# EasyEDA Pro project CH32V003J4M6 DIP8 Devboard.eprj

# Schematic DevboardSchematic
Board Name: Devboard2; Create Date: 2025-11-19; Page Name: P1; Project Name: CH32V003J4M6 DIP8 Devboard; Schematic Name: DevboardSchematic; Update Date: 2026-02-17; Company: m039; Drawn: Dmitry Mozgin; Page Size: A4; Version: V1.0
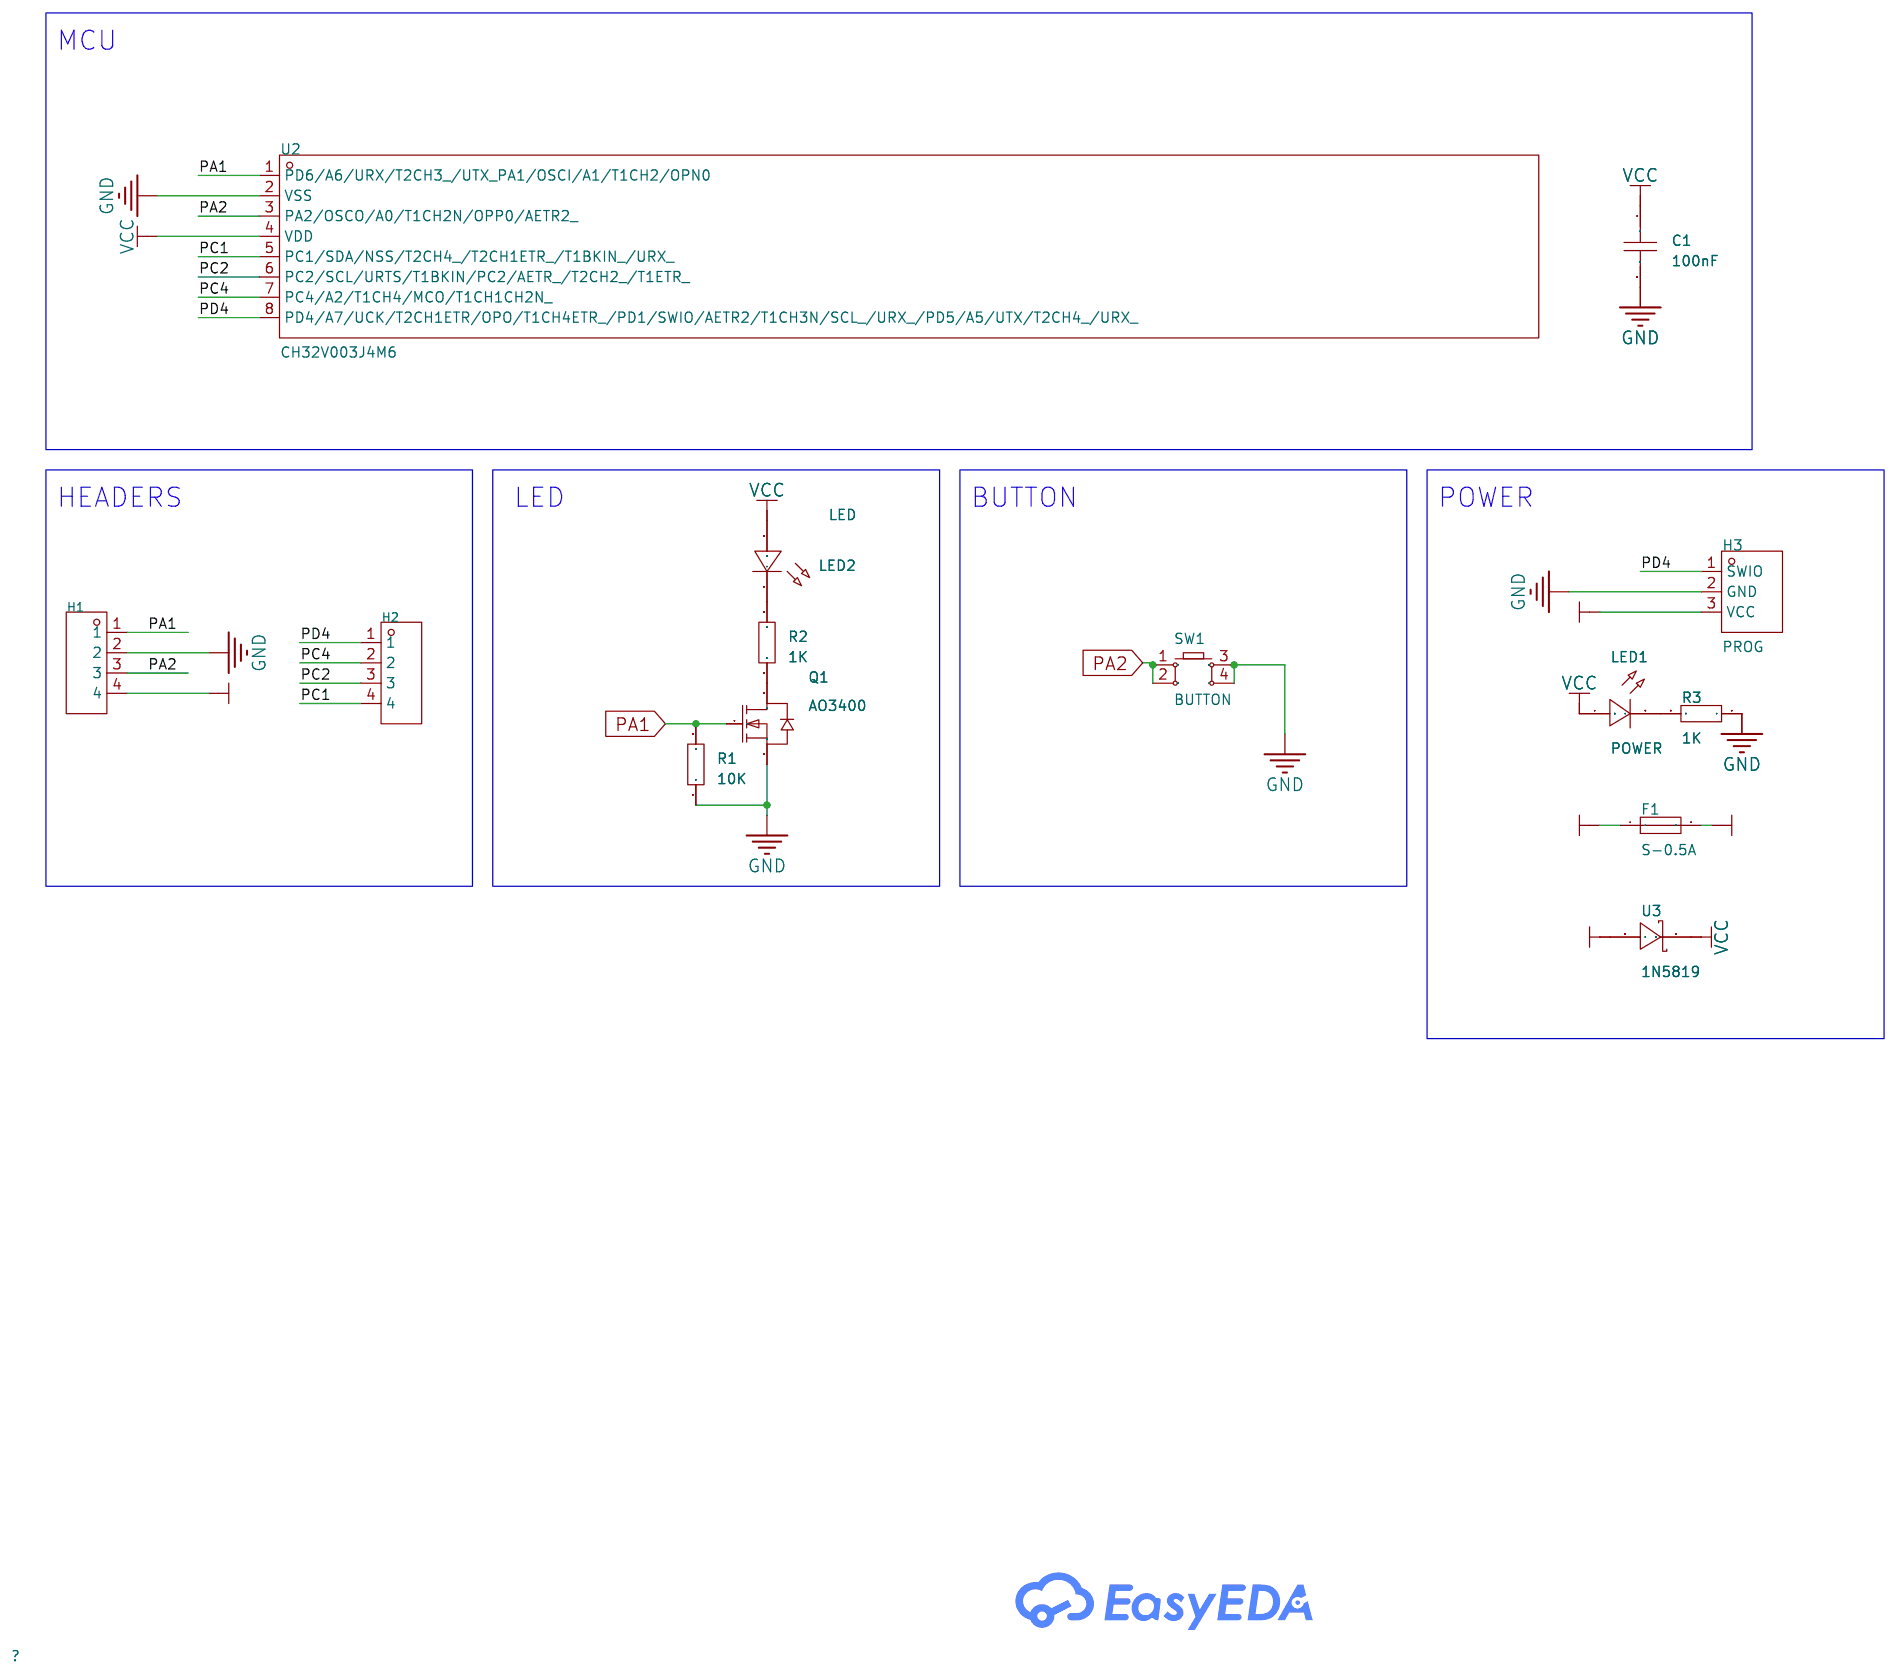
[diagram p0: schematic sheet]

## Parts
C1  100nF  [C0603]
F1  S-0.5A  [F0603]
H1  -  [HDR-TH_4P-P2.54-V-F]
H2  -  [HDR-TH_4P-P2.54-V-F]
H3  PROG  [HDR-TH_3P-P2.54-V-M]
LED1  POWER  [LED-TH_BD3.8-P2.54-FD_BLUE]
LED2  LED  [LED-TH_BD3.8-P2.54-FD_BLUE]
Q1  AO3400  [SOT-23-3_L2.9-W1.6-P1.90-LS2.8-BR]
R1  10K  [R0603]
R2  1K  [R0603]
R3  1K  [R0603]
SW1  BUTTON  [KEY-TH_4P-L6.0-W6.0-P3.90-LS6.5]
U2  CH32V003J4M6  [DIP-8_L9.6-W6.4-P2.54-LS7.9-BL]
U3  1N5819  [SOD-123_L2.7-W1.7-LS3.8-RD]

## Library data of the parts
C1 = CAP_0603: Supplier Footprint: 0603
F1 = S0603-S-1.0A: LCSC Part Name: 贴片式陶瓷保险丝; Supplier Part: C553912; Manufacturer: SART(萨特); Supplier Footprint: 0603; JLCPCB Part Class: Extended Part; Datasheet: https://item.szlcsc.com/datasheet/S0603-S-1.0A/574949.html; Supplier: LCSC; Type: Surface Mount Fuse; Current Rating: 1A; Voltage Rating (DC): 32V; Operating Temperature: -55℃~+125℃; Interrupt Rating: 50A
H1 H2 = HDR-F_2.54_1x4P: Supplier Footprint: Through
H3 = CH32V003 SWIO Header: Supplier Footprint: Through
LED1 LED2 = LED_TH-B_3mm: Supplier Footprint: Through
Q1 = AO3400: LCSC Part Name: N沟道,电流:5.8A,耐压:30V 停产; Supplier Part: C328570; Manufacturer: BLUE ROCKET(蓝箭); Supplier Footprint: SOT-23; JLCPCB Part Class: Extended Part; Datasheet: https://atta.szlcsc.com/upload/public/pdf/source/20190731/C328570_2ADA03E72CD1389EE9A38C5D753FA86A.pdf; Supplier: LCSC; Type: 1 N-channel; Drain Source On Resistance (RDS(on)@Vgs,Id): 32mΩ@10V,5.8A; Total Gate Charge (Qg@Vgs): 12nC@4.5V; Input Capacitance (Ciss@Vds): 1.03nF@15V; Reverse Transfer Capacitance (Crss@Vds): 77pF@15V; Operating Temperature: -55℃~+150℃
R1-R3 = Res_0603: Supplier Footprint: 0603
SW1 = Key_TH_6x6x4.5: Supplier Footprint: Through
U2 = CH32V003J4M6: Supplier Part: C9900030819; Supplier Footprint: SOP8; Supplier: LCSC
U3 = 1N5819/SOD-123: Supplier: LCSC; Supplier Part: C9900010912; Manufacturer: null; JLCPCB Part Class: Extended Part

## Nets
GND: C1.2 H1.2 H3.2(GND) Q1.2(S) R1.1 R3.1 SW1.3 SW1.4 U2.2(VSS)
VCC: C1.1 LED1.1(C) LED2.1(C) U2.4(VDD) U3.1(C)
VIN1: F1.1 H3.3(VCC) U3.2(A)
VIN2: F1.2 H1.4
PA1: H1.1 Q1.1(G) R1.2 U2.1(PD6/A6/URX/T2CH3_/UTX_PA1/OSCI/A1/T1CH2/OPN0)
PA2: H1.3 SW1.1 SW1.2 U2.3(PA2/OSCO/A0/T1CH2N/OPP0/AETR2_)
PC1: H2.4 U2.5(PC1/SDA/NSS/T2CH4_/T2CH1ETR_/T1BKIN_/URX_)
PC2: H2.3 U2.6(PC2/SCL/URTS/T1BKIN/PC2/AETR_/T2CH2_/T1ETR_)
PC4: H2.2 U2.7(PC4/A2/T1CH4/MCO/T1CH1CH2N_)
PD4: H2.1 H3.1(SWIO) U2.8(PD4/A7/UCK/T2CH1ETR/OPO/T1CH4ETR_/PD1/SWIO/AETR2/T1CH3N/SCL_/URX_/PD5/A5/UTX/T2CH4_/URX_)
$1N926: LED2.2(A) R2.2
$1N928: Q1.3(D) R2.1
$1N1002: LED1.2(A) R3.2

## Notes on the sheet
- MCU
- HEADERS
- LED
- BUTTON
- POWER

# Schematic DevboardSchematic_1
Board Name: Devboard1; Create Date: 2026-02-17; Page Name: P1; Project Name: CH32V003J4M6 DIP8 Devboard; Schematic Name: DevboardSchematic_1; Update Date: 2026-02-17; Company: m039; Drawn: Dmitry Mozgin; Page Size: A4; Version: V1.0
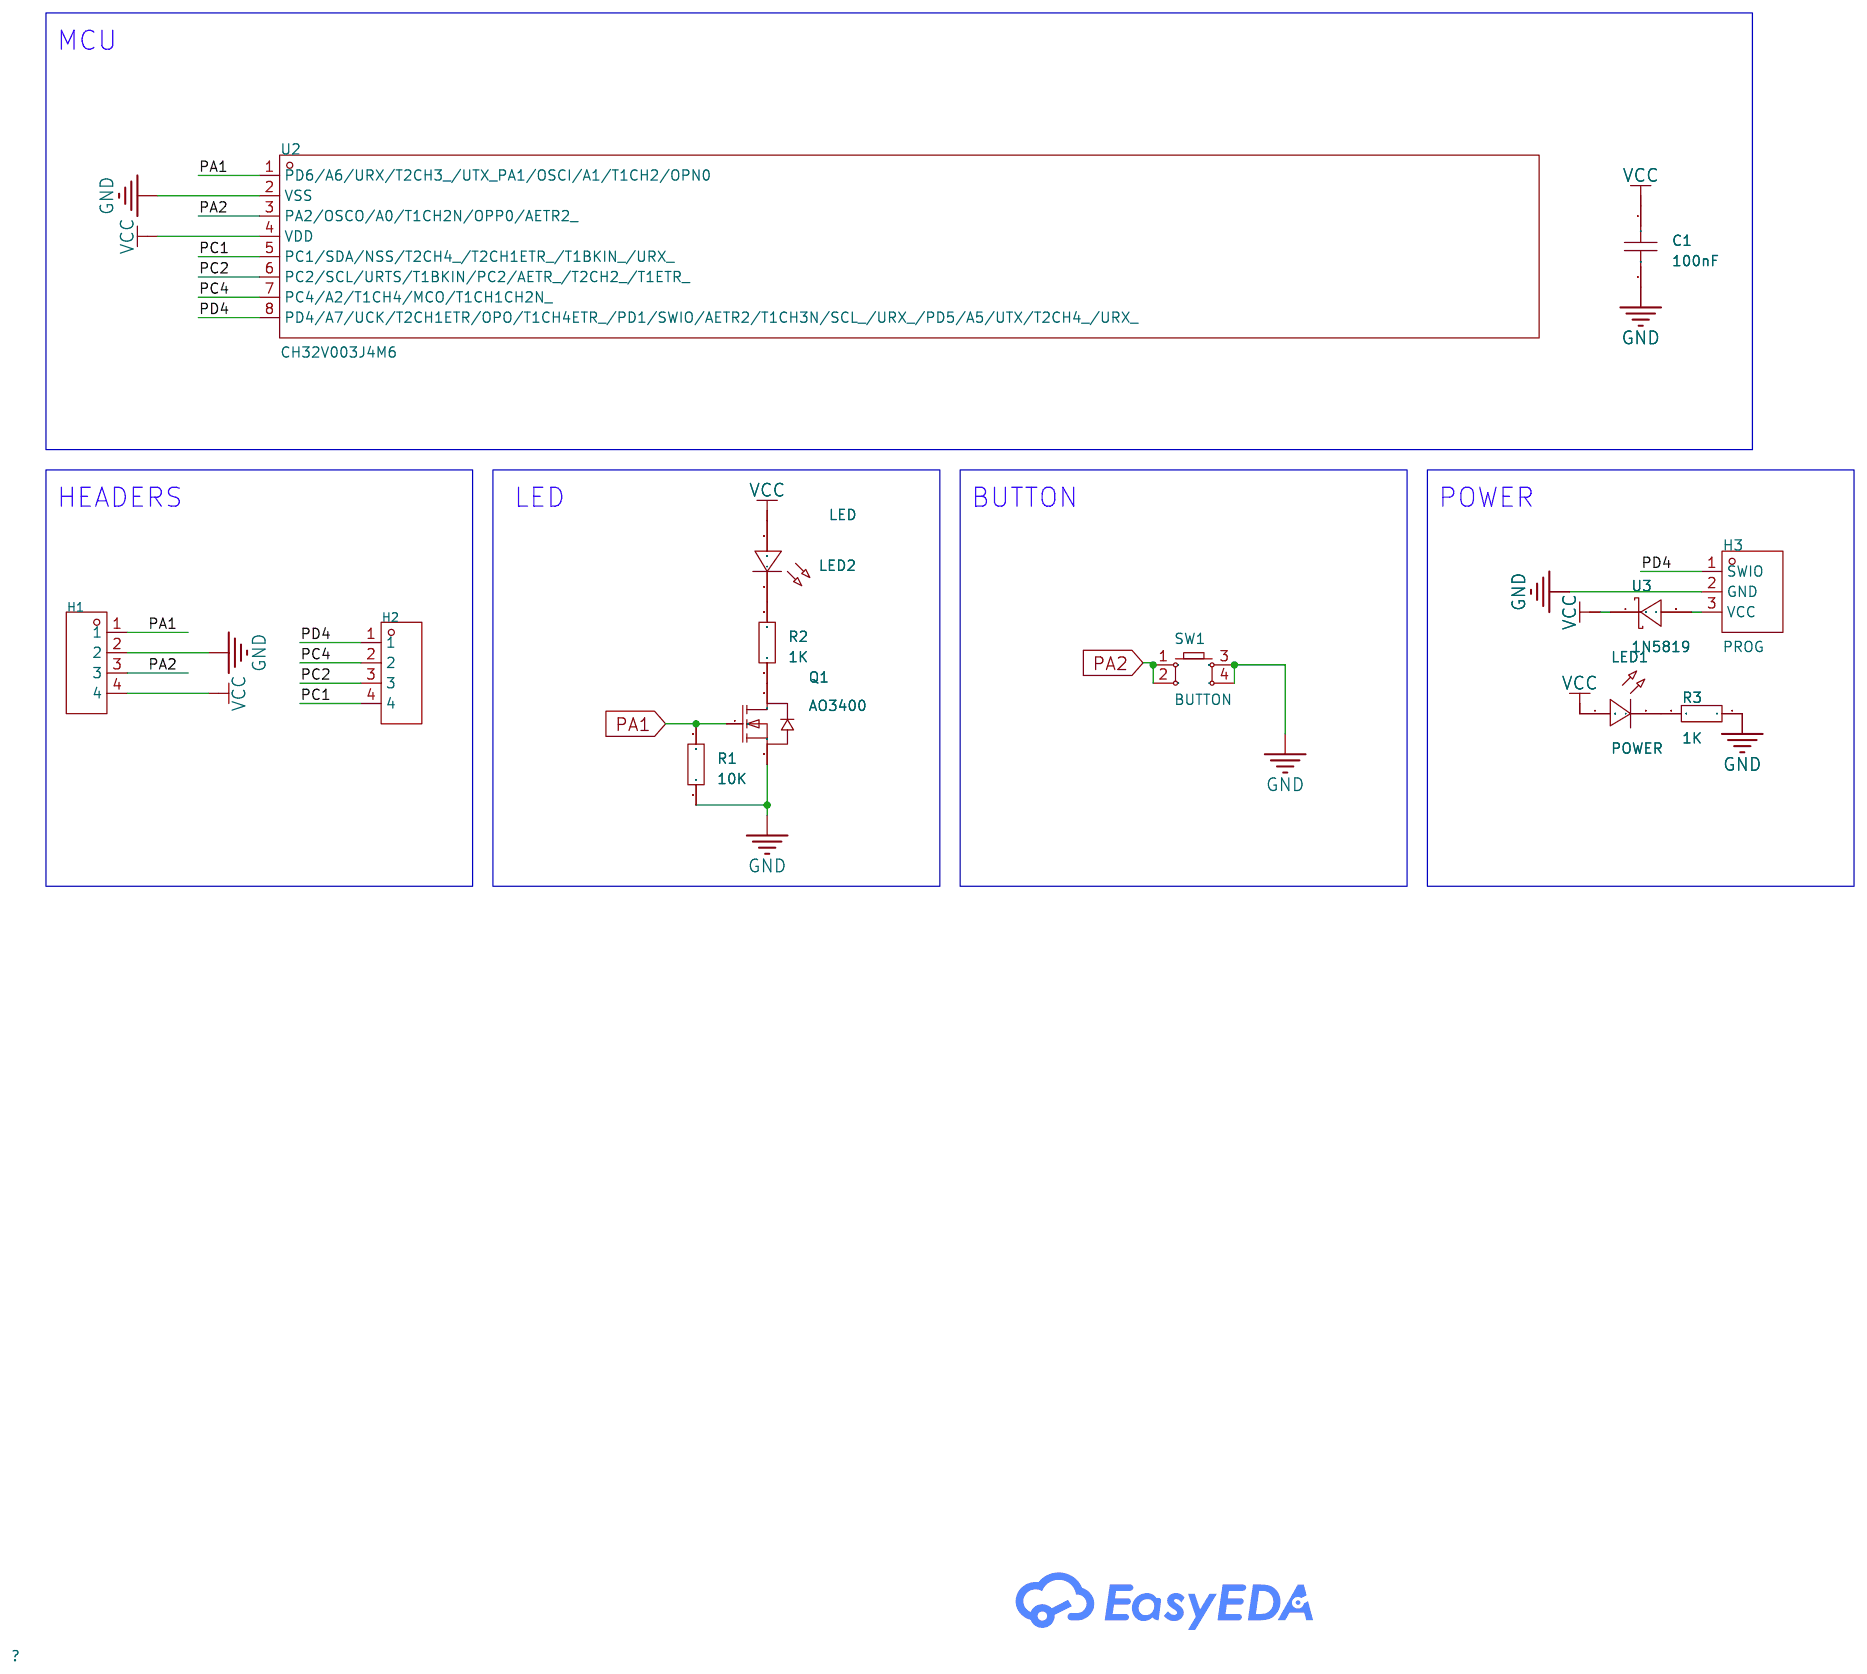
[diagram p1: schematic sheet]

## Parts
C1  100nF  [C0603]
H1  -  [HDR-TH_4P-P2.54-V-F]
H2  -  [HDR-TH_4P-P2.54-V-F]
H3  PROG  [HDR-TH_3P-P2.54-V-M]
LED1  POWER  [LED-TH_BD3.8-P2.54-FD_BLUE]
LED2  LED  [LED-TH_BD3.8-P2.54-FD_BLUE]
Q1  AO3400  [SOT-23-3_L2.9-W1.6-P1.90-LS2.8-BR]
R1  10K  [R0603]
R2  1K  [R0603]
R3  1K  [R0603]
SW1  BUTTON  [KEY-TH_4P-L6.0-W6.0-P3.90-LS6.5]
U2  CH32V003J4M6  [DIP-8_L9.6-W6.4-P2.54-LS7.9-BL]
U3  1N5819  [SOD-123_L2.7-W1.7-LS3.8-RD]

## Library data of the parts
C1 = CAP_0603: Supplier Footprint: 0603
H1 H2 = HDR-F_2.54_1x4P: Supplier Footprint: Through
H3 = CH32V003 SWIO Header: Supplier Footprint: Through
LED1 LED2 = LED_TH-B_3mm: Supplier Footprint: Through
Q1 = AO3400: LCSC Part Name: N沟道,电流:5.8A,耐压:30V 停产; Supplier Part: C328570; Manufacturer: BLUE ROCKET(蓝箭); Supplier Footprint: SOT-23; JLCPCB Part Class: Extended Part; Datasheet: https://atta.szlcsc.com/upload/public/pdf/source/20190731/C328570_2ADA03E72CD1389EE9A38C5D753FA86A.pdf; Supplier: LCSC; Type: 1 N-channel; Drain Source On Resistance (RDS(on)@Vgs,Id): 32mΩ@10V,5.8A; Total Gate Charge (Qg@Vgs): 12nC@4.5V; Input Capacitance (Ciss@Vds): 1.03nF@15V; Reverse Transfer Capacitance (Crss@Vds): 77pF@15V; Operating Temperature: -55℃~+150℃
R1-R3 = Res_0603: Supplier Footprint: 0603
SW1 = Key_TH_6x6x4.5: Supplier Footprint: Through
U2 = CH32V003J4M6: Supplier Part: C9900030819; Supplier Footprint: SOP8; Supplier: LCSC
U3 = 1N5819/SOD-123: Supplier: LCSC; Supplier Part: C9900010912; Manufacturer: null; JLCPCB Part Class: Extended Part

## Nets
GND: C1.2 H1.2 H3.2(GND) Q1.2(S) R1.1 R3.1 SW1.3 SW1.4 U2.2(VSS)
VCC: C1.1 H1.4 LED1.1(C) LED2.1(C) U2.4(VDD) U3.1(C)
PA1: H1.1 Q1.1(G) R1.2 U2.1(PD6/A6/URX/T2CH3_/UTX_PA1/OSCI/A1/T1CH2/OPN0)
PA2: H1.3 SW1.1 SW1.2 U2.3(PA2/OSCO/A0/T1CH2N/OPP0/AETR2_)
PC1: H2.4 U2.5(PC1/SDA/NSS/T2CH4_/T2CH1ETR_/T1BKIN_/URX_)
PC2: H2.3 U2.6(PC2/SCL/URTS/T1BKIN/PC2/AETR_/T2CH2_/T1ETR_)
PC4: H2.2 U2.7(PC4/A2/T1CH4/MCO/T1CH1CH2N_)
PD4: H2.1 H3.1(SWIO) U2.8(PD4/A7/UCK/T2CH1ETR/OPO/T1CH4ETR_/PD1/SWIO/AETR2/T1CH3N/SCL_/URX_/PD5/A5/UTX/T2CH4_/URX_)
$1N926: LED2.2(A) R2.2
$1N928: Q1.3(D) R2.1
$1N1002: LED1.2(A) R3.2
$1N2246: H3.3(VCC) U3.2(A)

## Notes on the sheet
- MCU
- HEADERS
- LED
- BUTTON
- POWER

# Board DevboardPCB
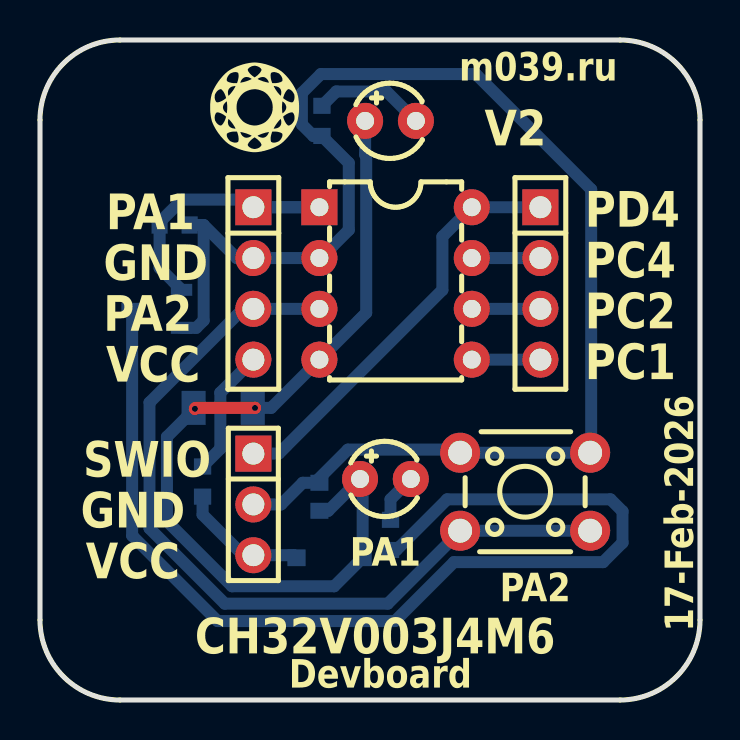
[diagram p2: board, top side]
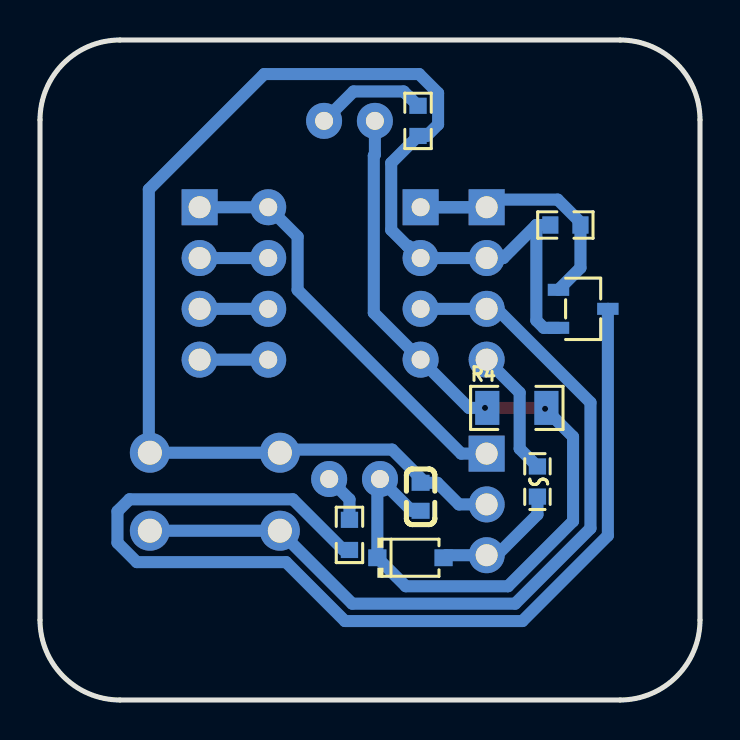
[diagram p3: board, bottom side, seen from below]

Outline 33 x 33 mm; copper layers: Top Layer, Bottom Layer. Coordinates in mm from the lower left corner of the outline.
Outline path: 0,29 0,4 arc(1.17,1.17) 4,0 29,0 arc(31.83,1.17) 33,4 33,29 arc(31.83,31.83) 29,33 4,33 arc(1.17,31.83) 0,29
Stack: Top Layer 0.035mm / Dielectric1 1.51mm FR4 er 4.5 / Bottom Layer 0.035mm

## Design rules (mm)
template: Custom Config
spacing copperThickness1oz (default): track to track 0.27, other pairs 0.152 to 0.3
spacing copperThickness2oz: track to track 0.203, other pairs 0.152 to 0.3
track width copperThickness1oz (default): min 0.127, default 0.6, max 2.54
track width copperThickness2oz: min 0.203, default 0.254, max 2.54
differential pair differentialPair (default): width min 0.127, default 0.254, max 2.54; gap min 0.152, default 0.152
via viaSize (default): diameter min 0.5, default 0.61, max 10; hole min 0.3, default 0.305, max 6.3

## Placement (name value [footprint] x y rotation side)
C1  100nF  [C0603]  13.97 10.16 90 bottom
F1  S-0.5A  [F0603]  8.13 10.92 90 bottom
H1  -  [HDR-TH_4P-P2.54-V-F]  10.67 20.83 270 top
H2  -  [HDR-TH_4P-P2.54-V-F]  25.02 20.83 270 top
H3  PROG  [HDR-TH_3P-P2.54-V-M]  10.67 9.78 270 top
LED1  POWER  [LED-TH_BD3.8-P2.54-FD_BLUE]  17.53 28.96 0 top
LED2  LED  [LED-TH_BD3.8-P2.54-FD_BLUE]  17.27 11.05 0 top
Q1  AO3400  [SOT-23-3_L2.9-W1.6-P1.90-LS2.8-BR]  5.84 19.56 0 bottom
R1  10K  [R0603]  6.73 23.75 180 bottom
R2  1K  [R0603]  17.53 8.25 90 bottom
R3  1K  [R0603]  14.1 28.96 90 bottom
R4  0R  [R1206]  9.16 14.61 180 bottom
SW1  BUTTON  [KEY-TH_4P-L6.0-W6.0-P3.90-LS6.5]  24.26 10.41 180 top
U2  CH32V003J4M6  [DIP-8_L9.6-W6.4-P2.54-LS7.9-BL]  17.78 20.83 270 top
U3  1N5819  [SOD-123_L2.7-W1.7-LS3.8-RD]  14.48 7.11 180 bottom

## Footprints (pads in the part's own frame, mm; a bottom-side part is the same pattern mirrored in y, then rotated)
C0603
  rect 0.8x0.9 smd: 1(-0.7,0) 2(0.7,0)
DIP-8_L9.6-W6.4-P2.54-LS7.9-BL
  rect 1.8x1.8 hole 0.9: 1(-3.81,-3.81)
  round 1.8 hole 0.9: 2(-1.27,-3.81) 3(1.27,-3.81) 4(3.81,-3.81) 5(3.81,3.81) 6(1.27,3.81) 7(-1.27,3.81) 8(-3.81,3.81)
F0603
  rect 0.806x0.864 smd: 1(-0.753,0) 2(0.753,0)
HDR-TH_3P-P2.54-V-M
  rect 1.8x1.8 hole 1.1x0.9: 1(-2.54,0)
  round 1.8 hole 1.1x0.9: 2(0,0) 3(2.54,0)
HDR-TH_4P-P2.54-V-F
  rect 1.8x1.8 hole 1.1x0.9: 1(-3.81,0)
  round 1.8 hole 1.1x0.9: 2(-1.27,0) 3(1.27,0) 4(3.81,0)
KEY-TH_4P-L6.0-W6.0-P3.90-LS6.5
  round 2 hole 1.2x0.9: 1(-3.25,1.95) 2(3.25,1.95) 3(-3.25,-1.95) 4(3.25,-1.95)
LED-TH_BD3.8-P2.54-FD_BLUE
  round 1.8 hole 0.9: 1(-1.27,0) 2(1.27,0)
R0603
  rect 0.806x0.864 smd: 1(-0.753,0) 2(0.753,0)
R1206
  rect 1.208x1.701 smd: 1(-1.479,0) 2(1.479,0)
SOD-123_L2.7-W1.7-LS3.8-RD
  rect 0.91x0.84 smd: 1(-1.655,0) 2(1.655,0)
SOT-23-3_L2.9-W1.6-P1.90-LS2.8-BR
  rect 1.07x0.6 smd: 1(1.235,-0.95) 2(1.235,0.95) 3(-1.235,0)

## Nets
As in the schematic, except:
VCC: C1.1 LED1.1 LED2.1 R4.1 R4.2 U2.4 U3.1

## Via types
v1: diameter 0.61, hole 0.305, Top Layer to Bottom Layer, 2 vias

## Routing (per net, layer and track width the routed paths; a pad name or vN(x,y) marks a point on that pad's centre or on a via; arc(x,y) is an arc through that point)
GND: length 72
  Bottom Layer w0.6: 14.09,28.2 13.67,28.2 13.09,28.77 13.09,30.35 14.04,31.3 21.79,31.3 27.56,25.53 27.56,12.42 SW1.3 SW1.4 20.39,12.36 20.23,12.52 15.39,12.52 13.73,10.86 ; 14.09,28.2 15.44,26.85 15.44,23.5 14.64,22.7 14.57,22.7 U2.2 H1.2 9.83,22.1 8.18,23.75 ; 14.09,28.2 R3.1 ; 13.73,10.86 13.13,10.86 12.05,9.78 H3.2 ; 13.73,10.86 C1.2 ; 8.18,23.75 R1.1 ; 8.18,23.75 8.18,18.98 7.81,18.61 7.08,18.61
VCC: length 44.8
  Top Layer w0.6: v1(7.75,14.56) 7.79,14.61 v1(10.75,14.61)
  Bottom Layer w0.6: v1(10.75,14.61) 11.56,14.61 U2.4 16.31,19.36 16.31,27.21 16.26,27.27 LED1.1 ; v1(7.75,14.56) 6.35,13.16 6.35,8.94 9.6,5.69 14.71,5.69 U3.1 16.13,10.92 LED2.1 14.41,9.46 C1.1
VIN1: length 6.5
  Bottom Layer w0.6: U3.2 12.7,7.24 10.16,7.24 8.13,9.27 F1.1
VIN2: length 6.4
  Bottom Layer w0.6: H1.4 9.02,15.37 9.02,12.56 F1.2
PA1: length 15.8
  Bottom Layer w0.6: 10.92,24.64 U2.1 10.92,24.64 ; 10.92,24.64 10.54,25.02 7.11,25.02 5.98,23.88 R1.2 5.98,21.61 7.08,20.51 ; 10.92,24.64 H1.1
PA2: length 41.8
  Bottom Layer w0.6: U2.3 10.16,19.56 5.48,14.88 5.48,8.58 9.24,4.82 17.39,4.82 21.04,8.46 SW1.1
PC1: length 3.4
  Bottom Layer w0.6: U2.5 H2.4
PC2: length 3.4
  Bottom Layer w0.6: U2.6 H2.3
PC4: length 3.4
  Bottom Layer w0.6: U2.7 H2.2
PD4: length 21.1
  Bottom Layer w0.6: H2.1 U2.8 20.12,23.17 20.12,20.5 11.94,12.32 H3.1 ; 10.5,12.32 10.58,12.4
$1N926: length 2.5
  Bottom Layer w0.6: R2.2 17.53,10.03 LED2.2
$1N928: length 53.7
  Bottom Layer w0.6: R2.1 17.82,7.5 20.36,10.03 28.53,10.03 29.13,9.43 29.13,7.86 28.16,6.89 20.7,6.89 17.75,3.95 8.88,3.95 4.61,8.22 Q1.3
$1N1002: length 5.6
  Bottom Layer w0.6: LED1.2 17.33,30.43 14.81,30.43 R3.2

## Text on the board
Top Silkscreen Layer: Devboard | 17-Feb-2026 | PA1 | PA2 | m039.ru | CH32V003J4M6 | V2 | GND | SWIO | VCC | PD4 | PC4 | PC2 | PC1

# Board DevboardPCB_1
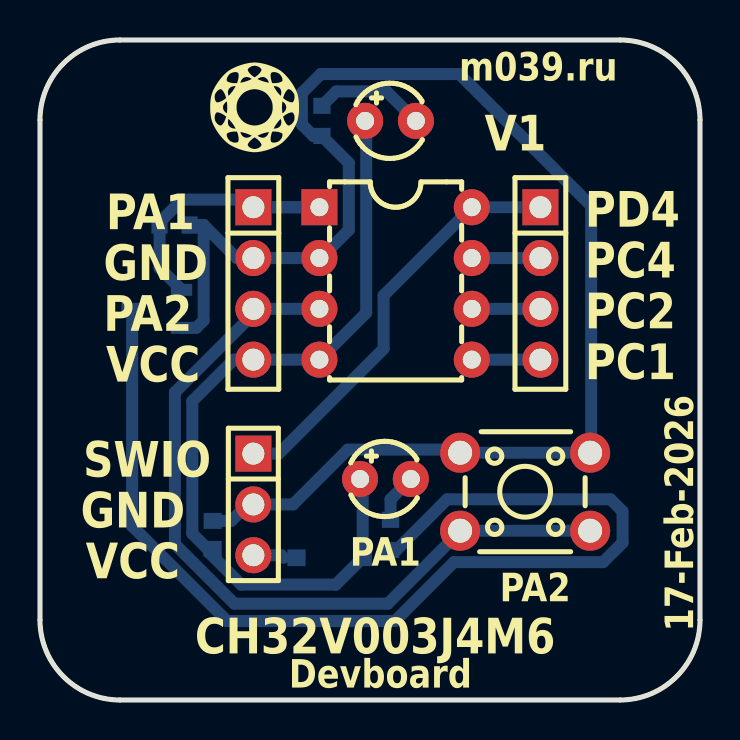
[diagram p4: board, top side]
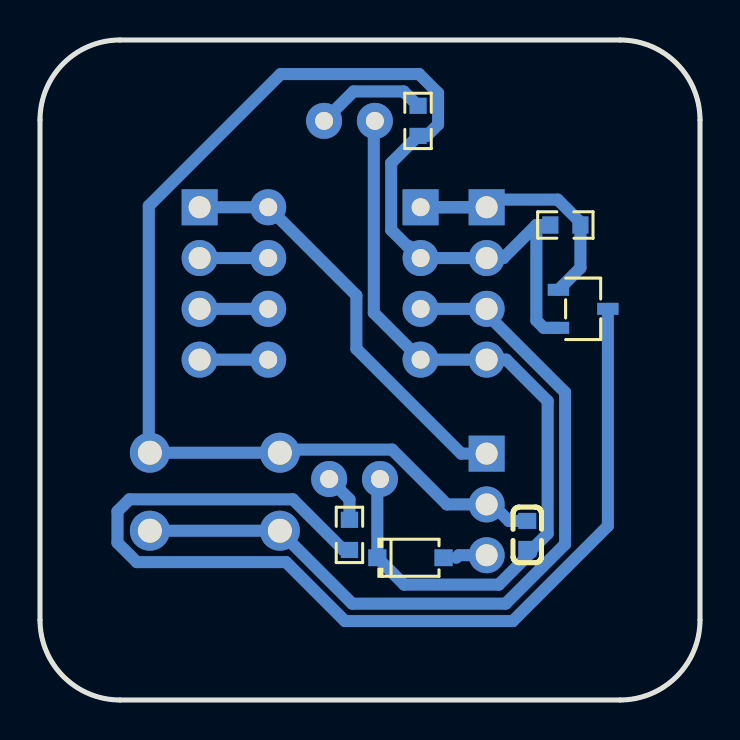
[diagram p5: board, bottom side, seen from below]

Outline 33 x 33 mm; copper layers: Top Layer, Bottom Layer. Coordinates in mm from the lower left corner of the outline.
Outline path: 0,29 0,4 arc(1.17,1.17) 4,0 29,0 arc(31.83,1.17) 33,4 33,29 arc(31.83,31.83) 29,33 4,33 arc(1.17,31.83) 0,29
Stack: Top Layer 0.035mm / Dielectric1 1.51mm FR4 er 4.5 / Bottom Layer 0.035mm

## Design rules (mm)
template: Custom Config
spacing copperThickness1oz (default): track to track 0.27, other pairs 0.152 to 0.3
spacing copperThickness2oz: track to track 0.203, other pairs 0.152 to 0.3
track width copperThickness1oz (default): min 0.127, default 0.6, max 2.54
track width copperThickness2oz: min 0.203, default 0.254, max 2.54
differential pair differentialPair (default): width min 0.127, default 0.254, max 2.54; gap min 0.152, default 0.152
via viaSize (default): diameter min 0.5, default 0.61, max 10; hole min 0.3, default 0.305, max 6.3

## Placement (name value [footprint] x y rotation side)
C1  100nF  [C0603]  8.64 8.25 90 bottom
H1  -  [HDR-TH_4P-P2.54-V-F]  10.67 20.83 270 top
H2  -  [HDR-TH_4P-P2.54-V-F]  25.02 20.83 270 top
H3  PROG  [HDR-TH_3P-P2.54-V-M]  10.67 9.78 270 top
LED1  POWER  [LED-TH_BD3.8-P2.54-FD_BLUE]  17.53 28.96 0 top
LED2  LED  [LED-TH_BD3.8-P2.54-FD_BLUE]  17.27 11.05 0 top
Q1  AO3400  [SOT-23-3_L2.9-W1.6-P1.90-LS2.8-BR]  5.84 19.56 0 bottom
R1  10K  [R0603]  6.73 23.75 180 bottom
R2  1K  [R0603]  17.53 8.25 90 bottom
R3  1K  [R0603]  14.1 28.96 90 bottom
SW1  BUTTON  [KEY-TH_4P-L6.0-W6.0-P3.90-LS6.5]  24.26 10.41 180 top
U2  CH32V003J4M6  [DIP-8_L9.6-W6.4-P2.54-LS7.9-BL]  17.78 20.83 270 top
U3  1N5819  [SOD-123_L2.7-W1.7-LS3.8-RD]  14.48 7.11 180 bottom

## Footprints (pads in the part's own frame, mm; a bottom-side part is the same pattern mirrored in y, then rotated)
C0603
  rect 0.8x0.9 smd: 1(-0.7,0) 2(0.7,0)
DIP-8_L9.6-W6.4-P2.54-LS7.9-BL
  rect 1.8x1.8 hole 0.9: 1(-3.81,-3.81)
  round 1.8 hole 0.9: 2(-1.27,-3.81) 3(1.27,-3.81) 4(3.81,-3.81) 5(3.81,3.81) 6(1.27,3.81) 7(-1.27,3.81) 8(-3.81,3.81)
HDR-TH_3P-P2.54-V-M
  rect 1.8x1.8 hole 1.1x0.9: 1(-2.54,0)
  round 1.8 hole 1.1x0.9: 2(0,0) 3(2.54,0)
HDR-TH_4P-P2.54-V-F
  rect 1.8x1.8 hole 1.1x0.9: 1(-3.81,0)
  round 1.8 hole 1.1x0.9: 2(-1.27,0) 3(1.27,0) 4(3.81,0)
KEY-TH_4P-L6.0-W6.0-P3.90-LS6.5
  round 2 hole 1.2x0.9: 1(-3.25,1.95) 2(3.25,1.95) 3(-3.25,-1.95) 4(3.25,-1.95)
LED-TH_BD3.8-P2.54-FD_BLUE
  round 1.8 hole 0.9: 1(-1.27,0) 2(1.27,0)
R0603
  rect 0.806x0.864 smd: 1(-0.753,0) 2(0.753,0)
SOD-123_L2.7-W1.7-LS3.8-RD
  rect 0.91x0.84 smd: 1(-1.655,0) 2(1.655,0)
SOT-23-3_L2.9-W1.6-P1.90-LS2.8-BR
  rect 1.07x0.6 smd: 1(1.235,-0.95) 2(1.235,0.95) 3(-1.235,0)

## Nets
As in the schematic.

## Routing (per net, layer and track width the routed paths; a pad name or vN(x,y) marks a point on that pad's centre or on a via; arc(x,y) is an arc through that point)
GND: length 73.7
  Bottom Layer w0.6: 14.09,28.2 R3.1 ; 14.09,28.2 13.67,28.2 13.09,28.77 13.09,30.35 14.04,31.3 20.97,31.3 27.56,24.7 27.56,12.42 SW1.3 SW1.4 20.39,12.36 20.23,12.52 15.39,12.52 12.65,9.78 10.38,9.78 9.56,8.95 C1.2 ; 14.09,28.2 15.44,26.85 15.44,23.5 14.64,22.7 14.57,22.7 U2.2 H1.2 9.83,22.1 8.18,23.75 ; 7.08,18.61 7.81,18.61 8.18,18.98 8.18,23.75 ; 8.18,23.75 R1.1
VCC: length 41.2
  Bottom Layer w0.6: 8.62,7.54 8.64,7.56 ; 8.62,7.54 8.4,7.54 7.62,8.32 7.62,14.95 9.69,17.02 H1.4 U2.4 16.31,19.36 16.31,28.9 LED1.1 ; 8.62,7.54 8.45,7.37 10.06,5.77 14.79,5.77 U3.1 16.13,10.92 LED2.1
PA1: length 15.8
  Bottom Layer w0.6: H1.1 10.92,24.64 ; 10.92,24.64 U2.1 10.92,24.64 ; 10.92,24.64 10.54,25.02 7.11,25.02 5.98,23.88 R1.2 5.98,21.61 7.08,20.51
PA2: length 40.3
  Bottom Layer w0.6: 10.92,19.56 6.75,15.38 6.75,7.79 9.72,4.82 17.39,4.82 21.04,8.46 SW1.1 ; 10.92,19.56 H1.3 ; 10.92,19.56 U2.3
PC1: length 3.4
  Bottom Layer w0.6: U2.5 H2.4
PC2: length 3.4
  Bottom Layer w0.6: U2.6 H2.3
PC4: length 3.4
  Bottom Layer w0.6: U2.7 H2.2
PD4: length 21.1
  Bottom Layer w0.6: H2.1 U2.8 17.18,20.23 17.18,17.56 11.94,12.32 H3.1 ; 10.5,12.32 10.58,12.4
$1N926: length 2.5
  Bottom Layer w0.6: LED2.2 17.53,10.03 R2.2
$1N928: length 53.4
  Bottom Layer w0.6: R2.1 17.82,7.5 20.36,10.03 28.53,10.03 29.13,9.43 29.13,7.86 28.16,6.89 20.7,6.89 17.75,3.95 9.36,3.95 4.61,8.7 Q1.3
$1N1002: length 5.6
  Bottom Layer w0.6: LED1.2 17.33,30.43 14.81,30.43 R3.2
$1N2246: length 1.6
  Bottom Layer w0.6: 10.67,7.24 12.06,7.24 12.19,7.11

## Text on the board
Top Silkscreen Layer: Devboard | 17-Feb-2026 | PA1 | PA2 | m039.ru | CH32V003J4M6 | V1 | GND | SWIO | VCC | PD4 | PC4 | PC2 | PC1
